# Altium schematic sheet Block_Pwr&Dbg.SchDoc
size A4
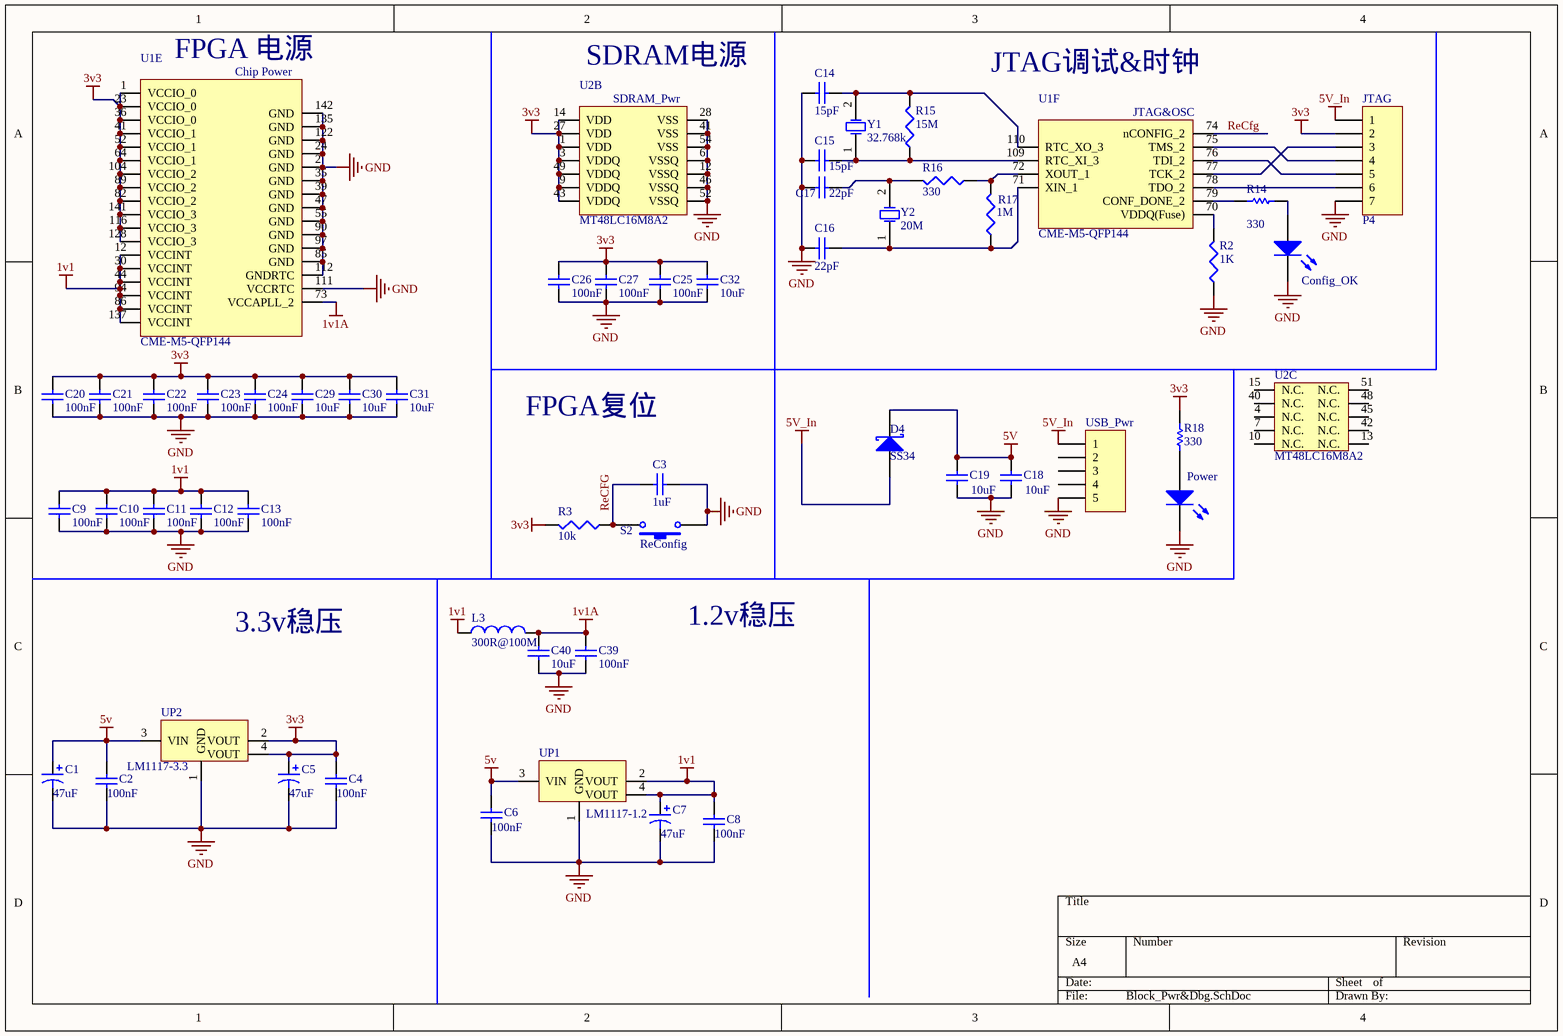
[diagram p0: Block_Pwr&Dbg.SchDoc]

## Parts
C1  value 47uF  [TanCap-1210]  (hidden comment: Cap Pol3)
C2  value 100nF  [6-0805_M]  (hidden comment: Cap)
C3  value 1uF  [6-0805_M]  (hidden comment: Cap)
C4  value 100nF  [6-0805_M]  (hidden comment: Cap)
C5  value 47uF  [TanCap-1210]  (hidden comment: Cap Pol3)
C6  value 100nF  [6-0805_M]  (hidden comment: Cap)
C7  value 47uF  [TanCap-1210]  (hidden comment: Cap Pol3)
C8  value 100nF  [6-0805_M]  (hidden comment: Cap)
C9  value 100nF  [6-0805_M]  (hidden comment: Cap)
C10  value 100nF  [6-0805_M]  (hidden comment: Cap)
C11  value 100nF  [6-0805_M]  (hidden comment: Cap)
C12  value 100nF  [6-0805_M]  (hidden comment: Cap)
C13  value 100nF  [6-0805_M]  (hidden comment: Cap)
C14  value 15pF  [6-0805_M]  (hidden comment: Cap)
C15  value 15pF  [6-0805_M]  (hidden comment: Cap)
C16  value 22pF  [6-0805_M]  (hidden comment: Cap)
C17  value 22pF  [6-0805_M]  (hidden comment: Cap)
C18  value 10uF  [6-0805_M]  (hidden comment: Cap)
C19  value 10uF  [6-0805_M]  (hidden comment: Cap)
C20  value 100nF  [6-0805_M]  (hidden comment: Cap)
C21  value 100nF  [6-0805_M]  (hidden comment: Cap)
C22  value 100nF  [6-0805_M]  (hidden comment: Cap)
C23  value 100nF  [6-0805_M]  (hidden comment: Cap)
C24  value 100nF  [6-0805_M]  (hidden comment: Cap)
C25  value 100nF  [6-0805_M]  (hidden comment: Cap)
C26  value 100nF  [6-0805_M]  (hidden comment: Cap)
C27  value 100nF  [6-0805_M]  (hidden comment: Cap)
C29  value 10uF  [6-0805_M]  (hidden comment: Cap)
C30  value 10uF  [6-0805_M]  (hidden comment: Cap)
C31  value 10uF  [6-0805_M]  (hidden comment: Cap)
C32  value 10uF  [6-0805_M]  (hidden comment: Cap)
C39  value 100nF  [6-0805_M]  (hidden comment: Cap)
C40  value 10uF  [6-0805_M]  (hidden comment: Cap)
Config_OK  LED2  [6-0805_Diode]  (value not drawn)
D4  SS34  [SMB]
JTAG  P4  [HDR1X7]
L3  value 300R@100M  [6-0805_M]  (hidden comment: Inductor)
Power  LED2  [6-0805_Diode]  (value not drawn)
R2  value 1K  [6-0805_M]  (hidden comment: Res3)
R3  value 10k  [6-0805_M]  (hidden comment: Res3)
R14  value 330  [6-0805_M]  (hidden comment: Res1)
R15  value 15M  [6-0805_M]  (hidden comment: Res3)
R16  value 330  [6-0805_M]  (hidden comment: Res3)
R17  value 1M  [6-0805_M]  (hidden comment: Res3)
R18  value 330  [6-0805_M]  (hidden comment: Res1)
ReConfig  S2  [Switch_SMT-022S-H2.5]
U1  CME-M5-QFP144  [QFP144N-50P2200X2200X160]  (parts E,F of 6)
U2  MT48LC16M8A2  [TSOP54-80P1180X100-]  (parts B,C of 3)
UP1  LM1117-1.2  [SOT223_M]
UP2  LM1117-3.3  [SOT223_M]
USB_Pwr  Header 5  [MicroUSB]  (value not drawn)
Y1  32.768k  [XTAL-3215]
Y2  20M  [XTAL-5032]

## Nets
1v1: C7.1 C8.2 C9.2 C10.2 C11.2 C12.2 C13.2 L3.1 U1.12(VCCINT) U1.30(VCCINT) U1.44(VCCINT) U1.86(VCCINT) U1.94(VCCINT) U1.137(VCCINT) UP1.2(VOUT) UP1.4(VOUT)
1v1A: C39.2 C40.2 L3.2 U1.73(VCCAPLL_2)
3v3: C4.2 C5.1 C20.2 C21.2 C22.2 C23.2 C24.2 C25.2 C26.2 C27.2 C29.2 C30.2 C31.2 C32.2 JTAG.2 R3.2 R18.1 U1.1(VCCIO_0) U1.23(VCCIO_0) U1.36(VCCIO_0) U1.41(VCCIO_1) U1.52(VCCIO_1) U1.64(VCCIO_1) U1.82(VCCIO_2) U1.89(VCCIO_2) U1.104(VCCIO_2) U1.116(VCCIO_3) U1.128(VCCIO_3) U1.141(VCCIO_3) U2.1(VDD) U2.3(VDDQ) U2.9(VDDQ) U2.14(VDD) U2.27(VDD) U2.43(VDDQ) U2.49(VDDQ) UP2.2(VOUT) UP2.4(VOUT)
5V: C1.1 C2.2 C6.2 C18.2 C19.2 D4.2(K) UP1.3(VIN) UP2.3(VIN)
5V_In: D4.1(A) JTAG.1 USB_Pwr.1
GND: C1.2 C2.1 C3.1 C4.1 C5.2 C6.1 C7.2 C8.1 C9.1 C10.1 C11.1 C12.1 C13.1 C14.1 C15.1 C16.1 C17.1 C18.1 C19.1 C20.1 C21.1 C22.1 C23.1 C24.1 C25.1 C26.1 C27.1 C29.1 C30.1 C31.1 C32.1 C39.1 C40.1 Config_OK.2(K) JTAG.7 Power.2(K) R2.1 ReConfig.1 U1.2(GND) U1.24(GND) U1.35(GND) U1.39(GND) U1.47(GND) U1.55(GND) U1.85(GND) U1.90(GND) U1.97(GND) U1.111(VCCRTC) U1.112(GNDRTC) U1.122(GND) U1.135(GND) U1.142(GND) U2.6(VSSQ) U2.12(VSSQ) U2.28(VSS) U2.41(VSS) U2.46(VSSQ) U2.52(VSSQ) U2.54(VSS) UP1.1(GND) UP2.1(GND) USB_Pwr.5
ReCfg: C3.2 R3.1 ReConfig.2 U1.74(nCONFIG_2)
NetC14_2: C14.2 R15.2 U1.110(RTC_XO_3) Y1.2(OSC2)
NetC15_2: C15.2 R15.1 U1.109(RTC_XI_3) Y1.1(OSC1)
NetC16_2: C16.2 R17.1 U1.71(XIN_1) Y2.1(OSC1)
NetC17_2: C17.2 R16.2 Y2.2(OSC2)
NetConfig_OK_1: Config_OK.1(A) R14.2
NetJTAG_3: JTAG.3 U1.77(TCK_2)
NetJTAG_4: JTAG.4 U1.75(TMS_2)
NetJTAG_5: JTAG.5 U1.76(TDI_2)
NetJTAG_6: JTAG.6 U1.78(TDO_2)
NetPower_1: Power.1(A) R18.2
NetR2_2: R2.2 U1.70(VDDQ(Fuse))
NetR14_1: R14.1 U1.79(CONF_DONE_2)
NetR16_1: R16.1 R17.2 U1.72(XOUT_1)

Not connected (* = marked no-connect by the designer): U2 4(N.C.) 7(N.C.) 10(N.C.) 13(N.C.) 15(N.C.) 40(N.C.) 42(N.C.) 45(N.C.) 48(N.C.) 51(N.C.); USB_Pwr 2 3 4

## Notes on the sheet
- (near U1) FPGA 电源
- (near U2) SDRAM电源
- JTAG调试&时钟
- FPGA复位
- 3.3v稳压
- 1.2v稳压
- (in symbol CME-M5-QFP144, part E) Chip Power
- (in symbol CME-M5-QFP144, part F) JTAG&OSC
- (in symbol SDRAM-8, part B) SDRAM_Pwr

## Library data of the parts
C1 C5 C7 = Cap Pol3: Polarized Capacitor (Surface Mount); Published: 8-Jun-2000; LatestRevisionDate: 29-May-2009; LatestRevisionNote: IPC-7351 Footprint Added.; PackageReference: C0805; Publisher: Altium Limited; PackageDescription: Chip Capacitor
C2-C4 C6 C8-C27 C29-C32 C39 C40 = Cap: Capacitor; Published: 8-Jun-2000; LatestRevisionDate: 17-Jul-2002; LatestRevisionNote: Re-released for DXP Platform.; PackageReference: RAD-0.3; Publisher: Altium Limited; PackageDescription: Radial Cap, Thru-Hole; 2 Leads; 0.3 in Pin Spacing
Config_OK Power = LED2: Typical RED, GREEN, YELLOW, AMBER GaAs LED; Published: 8-Jun-2000; LatestRevisionDate: 17-Jul-2002; LatestRevisionNote: Re-released for DXP Platform.; PackageVersion: Feb-2002; PackageReference: 3.2X1.6X1.1; Publisher: Altium Limited; PackageDescription: SM LED; 2 Flat Leads
D4 = D Schottky: Schottky Diode; Published: 8-Jun-2000; LatestRevisionDate: 17-Jul-2002; LatestRevisionNote: Re-released for DXP Platform.; PackageReference: SMB; Publisher: Altium Limited; PackageDescription: DO-214-AA/SMB; 2 C-Bend Leads; Body 5.3 x 3.6 mm, inc. leads (LxW); Code_JEDEC: DO-214-AA
JTAG = Header 7: Header, 7-Pin; LatestRevisionDate: 17-Jul-2002; LatestRevisionNote: Re-released for DXP Platform.; Publisher: Altium Limited
L3 = Inductor: Code_IEC: 1005; Published: 8-Jun-2000; LatestRevisionDate: 29-May-2009; LatestRevisionNote: IPC-7351 Footprint Added.; PackageReference: 0402-A; Publisher: Altium Limited; PackageDescription: Chip Inductor; Code_JEITA: 0402
R2 R3 R15-R17 = Res3: Resistor; Published: 8-Jun-2000; LatestRevisionDate: 29-May-2009; LatestRevisionNote: IPC-7351 Footprint Added.; PackageReference: J1-0603; Publisher: Altium Limited; PackageDescription: Chip Resistor
R14 R18 = Res1: Resistor; Published: 8-Jun-2000; LatestRevisionDate: 17-Jul-2002; LatestRevisionNote: Re-released for DXP Platform.; PackageReference: AXIAL-0.3; Publisher: Altium Limited; PackageDescription: Axial Device, Thru-Hole; 2 Leads; 0.3 in Pin Spacing
ReConfig = SW-PB: Switch; Published: 24-Mar-1999; LatestRevisionDate: 17-Jul-2002; LatestRevisionNote: Re-released for DXP Platform.; PackageReference: SPST-2; Publisher: Altium Limited; PackageDescription: Switch; 2 Leads
U2 = SDRAM-8
UP1 UP2 = LM1117
USB_Pwr = Header 5: Header, 5-Pin; LatestRevisionDate: 17-Jul-2002; LatestRevisionNote: Re-released for DXP Platform.; Publisher: Altium Limited
Y1 Y2 = XTAL: Crystal Oscillator; Published: 8-Jun-2000; LatestRevisionDate: 17-Jul-2002; LatestRevisionNote: Re-released for DXP Platform.; PackageReference: R38; Publisher: Altium Limited; PackageDescription: Crystal, Thru-Hole; 2 Leads; Body 3.1 x 8.2 mm (Dia.xH)